# Altium schematic sheet C2LH_CAPE_B2B.SchDoc
size A3; DocumentNumber: 2; SheetNumber: 2; SheetTotal: 8
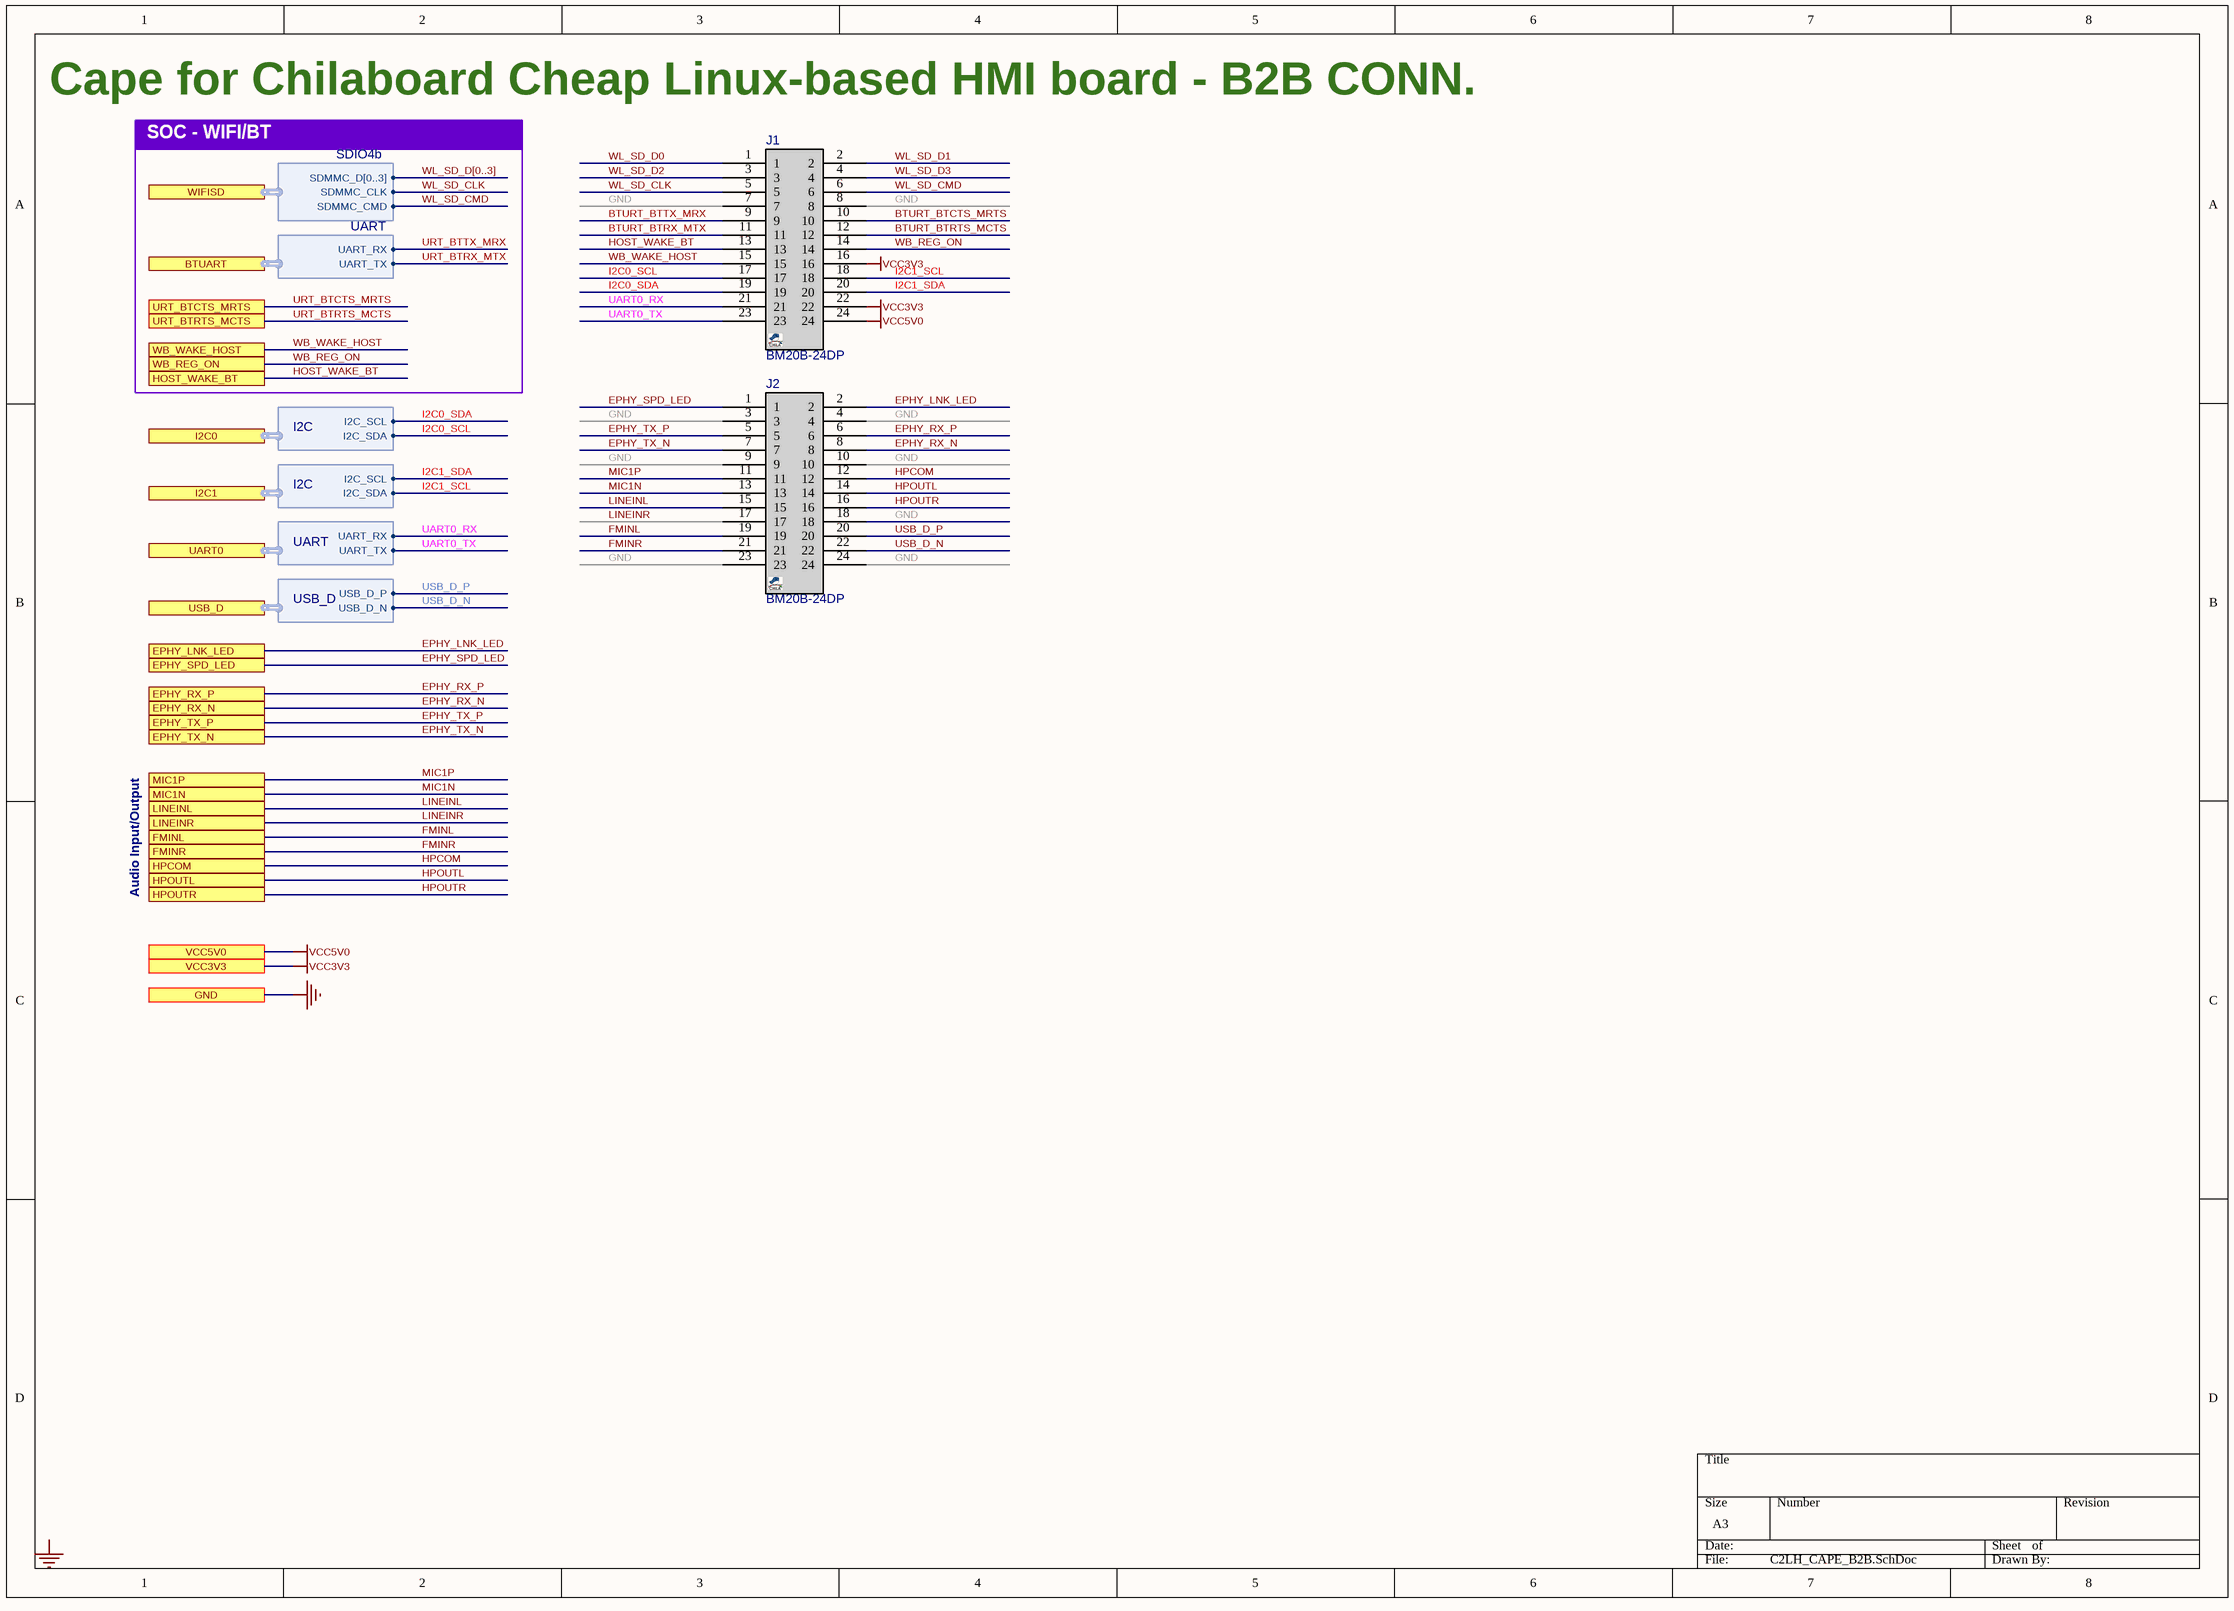
[diagram p0: C2LH_CAPE_B2B.SchDoc]

## Parts
J1  BM20B-24DP  [BM20B_24DP]
J2  BM20B-24DP  [BM20B_24DP]

## Ports
BTUART (harness UART), EPHY_LNK_LED, EPHY_RX_N, EPHY_RX_P, EPHY_SPD_LED, EPHY_TX_N, EPHY_TX_P, FMINL, FMINR, GND, HOST_WAKE_BT, HPCOM, HPOUTL, HPOUTR, I2C0 (harness I2C), I2C1 (harness I2C), LINEINL, LINEINR, MIC1N, MIC1P, UART0 (harness UART), URT_BTCTS_MRTS, URT_BTRTS_MCTS, USB_D (harness USB_D), VCC3V3, VCC5V0, WB_REG_ON, WB_WAKE_HOST, WIFISD (harness SDIO4b)

## Harnesses
UART: UART_RX, UART_TX
USB_D: USB_D_P, USB_D_N
SDIO4b: SDMMC_CMD, SDMMC_D[0..3], SDMMC_CLK
I2C: I2C_SCL, I2C_SDA

## Nets
GND: J1.7 J1.8 J2.3 J2.4 J2.9 J2.10 J2.18 J2.23 J2.24 ; port GND
VCC3V3: J1.16 J1.22 ; port VCC3V3
VCC5V0: J1.24 ; port VCC5V0
BTURT_BTCTS_MRTS: J1.10
BTURT_BTRTS_MCTS: J1.12
BTURT_BTRX_MTX: J1.11
BTURT_BTTX_MRX: J1.9
EPHY_LNK_LED: J2.2 ; port EPHY_LNK_LED
EPHY_RX_N: J2.8 ; port EPHY_RX_N
EPHY_RX_P: J2.6 ; port EPHY_RX_P
EPHY_SPD_LED: J2.1 ; port EPHY_SPD_LED
EPHY_TX_N: J2.7 ; port EPHY_TX_N
EPHY_TX_P: J2.5 ; port EPHY_TX_P
FMINL: J2.19 ; port FMINL
FMINR: J2.21 ; port FMINR
HOST_WAKE_BT: J1.13 ; port HOST_WAKE_BT
HPCOM: J2.12 ; port HPCOM
HPOUTL: J2.14 ; port HPOUTL
HPOUTR: J2.16 ; port HPOUTR
I2C0_SCL: J1.17 ; port I2C0.I2C_SDA
I2C0_SDA: J1.19 ; port I2C0.I2C_SCL
I2C1_SCL: J1.18 ; port I2C1.I2C_SDA
I2C1_SDA: J1.20 ; port I2C1.I2C_SCL
LINEINL: J2.15 ; port LINEINL
LINEINR: J2.17 ; port LINEINR
MIC1N: J2.13 ; port MIC1N
MIC1P: J2.11 ; port MIC1P
UART0_RX: J1.21 ; port UART0.UART_RX
UART0_TX: J1.23 ; port UART0.UART_TX
URT_BTCTS_MRTS: port URT_BTCTS_MRTS
URT_BTRTS_MCTS: port URT_BTRTS_MCTS
URT_BTRX_MTX: port BTUART.UART_TX
URT_BTTX_MRX: port BTUART.UART_RX
USB_D_N: J2.22 ; port USB_D.USB_D_N
USB_D_P: J2.20 ; port USB_D.USB_D_P
WB_REG_ON: J1.14 ; port WB_REG_ON
WB_WAKE_HOST: J1.15 ; port WB_WAKE_HOST
WL_SD_CLK: J1.5 ; port WIFISD.SDMMC_CLK
WL_SD_CMD: J1.6 ; port WIFISD.SDMMC_CMD
WL_SD_D0: J1.1
WL_SD_D1: J1.2
WL_SD_D2: J1.3
WL_SD_D3: J1.4

## Buses and harness runs
bus WL_SD_D[0..3]

## Notes on the sheet
- Cape for Chilaboard Cheap Linux-based HMI board - B2B CONN.
- SOC - WIFI/BT
- Audio Input/Output
- Labels drawn without touching a wire or pin: GND

## Library data of the parts
J1 J2 = BM20B-24DP: DF23 Series B2B Connectors; MANF: HIROSE; DESC: Mating BM20B(0.8)-24DS-0.4V(51); MANF_P#: BM20B(0.8)-24DP-0.4V(51); PRICE: 0.1$; VALUE: BM20B-24DP